# Altium schematic sheet 06_Power.SchDoc: Power
size A; Revision: A; SheetNumber: 6; SheetTotal: 8; ECE315_Project_Name: ECE453 MCU Base Project
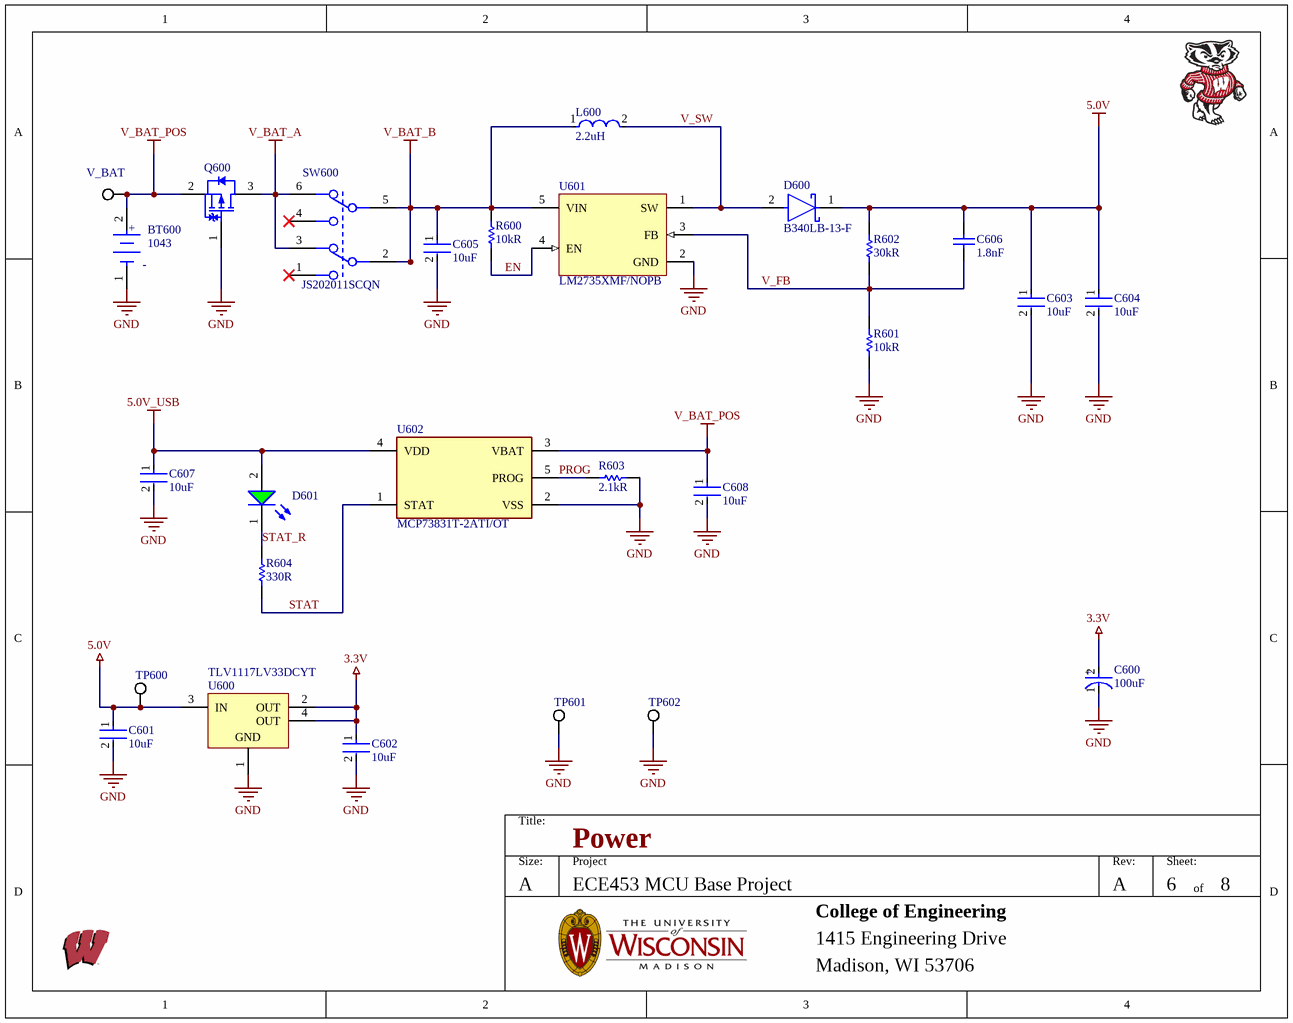
[diagram p0: 06_Power.SchDoc]

## Parts
BT600  1043  [BAT_1043]
C600  100uF  [FP-SD8-MFG]
C601  10uF  [FP-C0805C-DG-MFG]
C602  10uF  [FP-C0805C-DG-MFG]
C603  10uF  [FP-C0805C-DG-MFG]
C604  10uF  [FP-C0805C-DG-MFG]
C605  10uF  [FP-C0805C-DG-MFG]
C606  1.8nF  [CAPC2013X70X45LL10T25]
C607  10uF  [FP-C0805C-DG-MFG]
C608  10uF  [FP-C0805C-DG-MFG]
D600  B340LB-13-F  [FP-SMB-MFG]
D601  (no value)  [WL-SMCW_0805_150080xx75000]
L600  2.2uH  [FP-NR4018-MFG]
Q600  (no value)  [TOSH-SOT-23F_V]
R600  10kR  [RESC2013X60X35NL10T20]
R601  10kR  [RESC2013X60X35NL10T20]
R602  30kR  [RESC2013X70X40LL20T20]
R603  2.1kR  [RESC2013X70X40ML20T20]
R604  330R  [RESC2013X60X40LL20T25]
SW600  JS202011SCQN  [FP-JS202011SCQN-MFG]
TP600  (no value)  [KSTN-5019_V]
TP601  (no value)  [KSTN-5019_V]
TP602  (no value)  [KSTN-5019_V]
U600  TLV1117LV33DCYT  [DCY0004A_M]
U601  LM2735XMF/NOPB  [DBV0005A_N]
U602  MCP73831T-2ATI/OT  [FP-C04-091-OT-IPC_C]
V_BAT  (no value)  [KSTN-5019_V]

## Nets
3.3V: C600.2(A) C602.1 U600.2(OUT) U600.4(OUT)
5.0V: C601.1 C603.1 C604.1 C606.2 D600.1(C) R602.2 TP600.1 U600.3(IN)
5.0V_USB: C607.1 D601.2(A) U602.4(VDD)
GND: BT600.1(C) C600.1(C) C601.2 C602.2 C603.2 C604.2 C605.2 C607.2 C608.2 Q600.1(G) R601.1 R603.2 TP601.1 TP602.1 U600.1(GND) U601.2(GND) U602.2(VSS)
V_BAT_A: Q600.3(D) SW600.3 SW600.6
V_BAT_B: C605.1 L600.1 R600.2 SW600.2 SW600.5 U601.5(VIN)
V_BAT_POS: BT600.2(A) C608.1 Q600.2(S) U602.3(VBAT) V_BAT.1
EN: R600.1 U601.4(EN)
PROG: R603.1 U602.5(PROG)
STAT: R604.2 U602.1(STAT)
STAT_R: D601.1(K) R604.1
V_FB: C606.1 R601.2 R602.1 U601.3(FB)
V_SW: D600.2(A) L600.2 U601.1(SW)

Not connected (* = marked no-connect by the designer): SW600 1* 4*

## Notes on the sheet
- Title:
- Size:
- A
- Project
- Rev:
- Sheet:
- of
- College of Engineering
- 1415 Engineering Drive
- Madison, WI 53706
- (in symbol 1043) +
- (in symbol CMP-05427-000061-1) +

## Library data of the parts
BT600 = 1043: Conn Terminal Strip 2 POS Solder Lug ST; pin to pad: 1>N 2>P; Manufacturer 1: Keystone Electronics; Body Material: Nylon; Number of Cells: 1; Supplier: Digi-Key; Supplier Part Number: 36-1043-ND; RoHS: Yes; Category: Passive Components; Stock 1: 3564; Pricing 1: 1=3.00000, 25=2.52400, 100=2.08850, 250=1.92020, 500=1.80144 (USD); Mount: Through Hole,PCB; Number of Pins: 1; Contact Plating: Gold; Material: Nylon; Contact Material: Stainless Steel; Min Operating Temperature: -50°C; Max Operating Temperature: 145°C; Package Quantity: 100; Packaging: Tray; Termination: PC Pin; ComponentLink1URL: https://datasheet.ciiva.com/4/1043-4710.pdf?src-supplier=Digi-Key; ComponentLink1Description: https://datasheet.ciiva.com/4/1043-4710.pdf?src-supplier=Digi-Key; ComponentLink2URL: https://datasheet.ciiva.com/3353/1043-eng-tds-3353208.pdf?src-supplier=Distrelec; ComponentLink2Description: https://datasheet.ciiva.com/3353/1043-eng-tds-3353208.pdf?src-supplier=Distrelec; ComponentLink3URL: https://datasheet.ciiva.com/41803/1043-41803215.pdf?src-supplier=Digi-Key; ComponentLink3Description: https://datasheet.ciiva.com/41803/1043-41803215.pdf?src-supplier=Digi-Key; ComponentLink4URL: https://datasheet.ciiva.com/4642/1043-4642493.pdf?src-supplier=Mouser; ComponentLink4Description: https://datasheet.ciiva.com/4642/1043-4642493.pdf?src-supplier=Mouser; Manufacturer: Keystone Electronics; Manufacturer Part Number: 1043; Stock: 4788; Pricing: 1=2.85, 10=2.62, 25=2.39, 50=2.18, 100=1.97, 500=1.7 (USD); Mounting Technology: Through Hole,PCB; Pins: 1; Series: -; Manufacturer Part Number 1: 1043
C600 = CMP-05427-000061-1: CAP ALUM 100UF 20% 25V SMD; Leakage Current: 3uA; Life (Hours): 2000Hour; Ripple Current: 143mA; Polarity: Polar; Height - Seated (Max): 0.303inch; Contact Plating: Tin; Max Operating Temperature: 85°C; Package Quantity: 900; RoHS Compliant: Yes; Termination: SMD/SMT; Lead Free: Lead Free; Min Operating Temperature: -40°C; Radiation Hardening: No; Length: 8mm; Height: 7.7mm; Series: S; Voltage Rating: 25V; Capacitance: 100uF; Diameter: 6.3mm; Ripple Current (AC): 143mA; Case/Package: Radial; Packaging: Tape and Reel; Voltage: 25V; Tolerance: 20%; Construction: Cylindrical; Voltage Rating (DC): 25V; Mount: Surface Mount
C601-C605 C607 C608 = CMP-2007-03243-2: CAP CER 10UF 10V X5R 0805; Manufacturer Part Number: C0805C106K8PACTU; Manufacturer: Kemet; 3DS Part Number: 220-00001; Tolerance: 10%; Temperature Coefficient: 15%; Material: Ceramic; Device Class L2: Capacitors; Device Class L1: Passive Components; ComponentLink2URL: https://content.kemet.com/datasheets/KEM_C1006_X5R_SMD.pdf; Height: 1.4mm; Lead Free: Yes; Digikey Description: CAP CER 10UF 10V X5R 0805; Octopart: https://octopart.com/c0805c106k8pactu-kemet-98697; Capacitance: 10uF; Value: 10uF; Temperature Range Low: -55°C; Temperature: -55°C to +85°C; Automotive: No; Mouser Description: CAP CER 10UF 10V X5R 0805; Ipc Land Pattern Name: CAPC200125X125; Temperature Range High: +85°C; Voltage: 10V; RoHS: TRUE; Device Class L3: Ceramic Capacitors; ComponentLink2Description: Datasheet; Voltage Rating: 10V; Package: C0805C-DG; Temperature Characteristic: X5R; Category: Cap
C606 = CMP-1036-03191-3: Part Number: GRM2165C1H182JA01D; Manufacturer: Murata
D600 = CMP-12790-000022-1: DIODE SCHOTTKY 40V 3A SMB; Manufacturer: Diodes Inc.; Max Surge Forward Current: 70A; Value: 180pF; Peak Reverse Current: 2mA; Standoff Height: 0.05mm; Max Junction Temp: +150°C; Device Class L2: Diodes; Octopart: https://octopart.com/b340lb-13-f-diodes+inc.-325823; Device Class L1: Discrete Semiconductors; Forward Current: 3A; Automotive: No; Manufacturer Part Number: B340LB-13-F; Temperature: -55°C to +150°C; Temperature Range Low: -55°C; Max Repetitive Reverse Voltage: 40V; Device Class L3: Schottky Diodes; RoHS: TRUE; Height: 2.5mm; ComponentLink2URL: https://www.diodes.com/assets/Datasheets/ds30240.pdf; Package: SMB; Digikey Description: DIODE SCHOTTKY 40V 3A SMB; Lead Free: Yes; Category: Diode; Reverse Voltage: 40V; Mouser Description: Schottky Diodes & Rectifiers 40V 3A; ComponentLink2Description: Datasheet; Footprint Url: https://www.diodes.com/assets/Package-Files/SMB.pdf; Temperature Range High: +150°C; Capacitance: 180pF
D601 = CMP-1426-00007-2: NexarPartId: 29717780; Wavelength: 520nm; Forward Current: 100mA; Lens Style: Clear, Rectangular; Dominant Wavelength: 525nm; Max Junction Temperature (Tj): 95°C; Power Dissipation: 105mW; Luminous Intensity: 450mcd; Peak Wavelength: 515nm; Color: Green; Viewing Angle: 140°; Test Current: 20mA; Reverse Voltage: 5V; Forward Voltage: 3.2V; Mount: Surface Mount; REACH SVHC: Unknown; Min Operating Temperature: -40°C; Case Code (Imperial): 0805; Case/Package: 0805; Max Operating Temperature: 85°C; RoHS: Compliant; Length: 2mm; Height: 700µm; Width: 1.25mm; Case Code (Metric): 2012; Packaging: Tape and Reel; Max Reverse Voltage (DC): 5V
L600 = CMP-14484-000071-2: SMD Power Inductors 2.2uH ±20% 2.2A 50.4mΩ; Test Frequency: 100kHz; Shielding: Shielded; Core Material: Ferrite; Saturation Current: 3A; Self Resonant Frequency: 60MHz; DC Resistance (DCR): 50.4mR; Height - Seated (Max): 0.071inch; RMS Current (Irms): 2.2A; Min Operating Temperature: -25°C; RoHS Compliant: Yes; Max Operating Temperature: 125°C; Package Quantity: 3500; Halogen Free: Halogen Free; Number of Pins: 2; Packaging: Tape and Reel; Inductance Tolerance: 20%; Lead Pitch: 2.8mm; Width: 0.157inch; Max DC Current: 3A; Tolerance: 20%; Length: 4mm; Resistor Type: Wirewound; Depth: 4.2mm; Current Rating: 2.2A; Lead Free: Lead Free; Series: NRS; Termination: SMD/SMT; Radiation Hardening: No; Mount: Surface Mount; Height: 1.8mm; Inductance: 2.2uH; Case/Package: Nonstandard
Q600 = CMP-2100-03686-1: TOSHIBA Field-Effect Transistor Silicon P-Channel MOS Type (U-MOS VI), 20 V, -55 to 125 degC, 3-Pin SOTFL, RoHS, Tape and Reel; Gate to Source Voltage (Vgs): 8V; Drain to Source Breakdown Voltage: -20V; Turn-Off Delay Time: 107ns; Continuous Drain Current (ID): 6A; Rds On Max: 29.8mOhm; Number of Elements: 1; Turn-On Delay Time: 32ns; Drain to Source Resistance: 47.4mOhm; Drain to Source Voltage (Vdss): 20V; Power Dissipation: 2W; Element Configuration: Single; Max Power Dissipation: 1W; Input Capacitance: 840pF; Manufacturer URL: http://www.toshiba.com/; Number of Pins: 3; Number of Channels: 1; Max Operating Temperature: 150degC; Min Operating Temperature: -55degC; Manufacturer: Toshiba; Mount: SurfaceMount; Package Description: 3-Pin Small Outline Transistor, Flat Lead, Body 2.9 x 1.8 mm, Pitch 0.95 mm; Radiation Hardening: No; Package Quantity: 3000; Package Reference: SOT-23F; RoHSCompliant: true; Package URL: https://toshiba.semicon-storage.com/ap-en/design-support/package/detail.SOT-23F.html; Packaging: TapeandReel; Datasheet Version: 41699.0; Case/Package: SOT-23-3; Datasheet URL: https://toshiba.semicon-storage.com/info/docget.jsp?did=2429&prodName=SSM3J328R
R600 R601 = CMP-1659-00013-4: Chip Resistor, 10 KOhm, +/- 1%, 0.125 W, -55 to 155 degC, 0805 (2012 Metric), RoHS, Tape and Reel; Manufacturer: Yageo; Voltage Rating: 150 V; Mount: Surface Mount; ComponentLink1Description: Manufacturer URL; ComponentLink2URL: http://www.yageo.com/documents/recent/PYu-RC_Group_51_RoHS_L_04.pdf; Pins: 2; Length: 2 mm; Min Operating Temperature: -55 degC; Height: 0.5 mm; Mounting Technology: Surface Mount; RoHSCompliant: true; REACH SVHC: No SVHC; ComponentLink1URL: http://www.yageo.com/; Max Operating Temperature: 155 degC; PackageReference: 0805; DatasheetVersion: Rev. 4, 02/2016; Package Quantity: 5000; Packaging: Tape and Reel; ComponentLink2Description: Datasheet; PackageDescription: 2-Pin Surface Mounted Device, Body 2 x 1.25 mm
R602 = CMP-1013-00675-4: RES 30.0K OHM 1/8W 1% 0805 SMD; Manufacturer: Panasonic; PartNumber: ERJ-6ENF3002V; ComponentLink1URL: http://industrial.panasonic.com/cdbs/www-data/pdf/RDA0000/AOA0000C86.pdf; ComponentLink1Description: Datasheet; PackageReference: 0805
R603 = CMP-2001-00036-1: Part Number: ERJ-6ENF2101V; Manufacturer: Panasonic
R604 = CMP-2001-00628-1: Manufacturer: Panasonic; Part Number: ERA6AEB331V
SW600 = CMP-2000-05087-3: SWITCH SLIDE DPDT 300MA 6V; Switch Function: On-On; Actuator Type: Standard; Switch Travel: 2mm; Actuator Color: Black; Contact Resistance: 70mR; Electrical Life: 5000Cycles; Actuator Material: Nylon; REACH SVHC: No SVHC; Series: JS; Min Operating Temperature: -20°C; Depth: 7.5mm; Housing Material: Nylon; Voltage Rating (DC): 6V; Max Operating Temperature: 85°C; Contact Current Rating: 300mA; Package Quantity: 1; Contact Plating: Silver; Contact Material: Copper Alloy; Throw Configuration: DPDT; Current Rating: 300mA; Orientation: Vertical; Max Current Rating: 300mA; Max Voltage Rating (DC): 6V; Flammability Rating: UL94 V-2; Length: 9mm; Packaging: Tape and Reel; Mount: Surface Mount; Actuator Length: 2mm; Lead Free: Lead Free; Termination: Gull Wing; Radiation Hardening: No
TP600-TP602 V_BAT = CMP-1672-00008-1: Test Point, 1 Position SMD, RoHS, Tape and Reel; ComponentLink1Description: Manufacturer URL; Package Quantity: 1000; DatasheetVersion: 03/2014; Packaging: Tape and Reel; ComponentLink2URL: http://www.keyelco.com/product-pdf.cfm?p=1357; ComponentLink1URL: http://www.keyelco.com/; Mount: Surface Mount; Contact Plating: Silver; PackageDescription: 1-Pin Surface Mount Device, Body 3.81 x 2.03 mm; Pins: 1; RoHSCompliant: True; Mounting Technology: Surface Mount; ComponentLink2Description: Datasheet; PackageReference: 5019
U600 = CMP-0395-00499-2: Single Output LDO, 1 A, Fixed 3.3 V Output, 2 to 5.5 V Input, 4-pin SOT-223 (DCY), -40 to 125 degC, Green (RoHS & no Sb/Br); Manufacturer: Texas Instruments; Vout Adj(Max)(V): 3.3; Iout(Max)(A): 1; SubFamily: Single Channel LDO; Iq(Typ)(mA): 0.05; Accuracy(%): 2; Vin(Max)(V): 5.5; Vdo(Typ)(mV): 1200; PartNumber: TLV1117LV33DCYT; PackageReference: DCY0004A; PackageVersion: 4202506/B; ComponentLink1URL: http://www.ti.com/; DatasheetVersion: SBVS160A; Mounting Technology: Surface Mount; Fixed Output Options(V): 3.3; ComponentLink3Description: Package Specification; PackageDescription: 4-Pin Plastic Small Outline, Body 3.5 x 6.5 mm, Pitch 2.3 mm; Vout Adj(Min)(V): 3.3; ComponentLink2URL: http://www.ti.com/general/docs/lit/getliterature.tsp?genericPartNumber=TLV1117LV33&fileType=pdf; Code_JEDEC: TO-261; ComponentLink1Description: Manufacturer URL; Vin(Min)(V): 2; ComponentLink2Description: Datasheet; Eco-Plan: Green (RoHS & no Sb/Br); ComponentLink3URL: http://www.ti.com/litv/pdf/mpds094a
U601 = CMP-0069-01217-3: 520kHz/1.6MHz - Space-Efficient Boost and SEPIC DC-DC Regulator, 5-pin SOT-23, Pb-Free; Manufacturer: Texas Instruments; PackageTopMarking: SLEB*XTT; PowerWise: N; CompType: Switcher; ComponentLink1URL: http://www.ti.com/general/docs/lit/getliterature.tsp?genericPartNumber=LM2735&fileType=pdf; PackageReference: DBV0005A; PinCount: 5; RoHS: Y; PackageDescription: Molded SOT-23, .115 x .063 x .040 in Body, 5 Lead, .0375 in Pitch; ComponentLink1Description: Datasheet URL
U602 = CMP-0133-00144-2: IC CONTROLLR LI-ION 4.2V SOT23-5; Max Supply Voltage: 6V; Max Output Current: 500mA; Min Output Voltage: 4.168V; Max Output Voltage: 4.232V; Min Supply Voltage: 3.75V; Number of Cells: 1; Lead Free: Lead Free; Number of Pins: 5; Package Quantity: 3000; Min Operating Temperature: -40°C; Width: 1.8mm; Max Charge Current: 500mA; Output Current: 500mA; Packaging: Tape and Reel; Height: 1.3mm; Output Voltage: 4.2V; Max Operating Temperature: 85°C; Mount: Surface Mount; Case/Package: SOT-23; Length: 3.1mm; REACH SVHC: No SVHC